# EAGLE schematic atividade-02 (EAGLE 9.6.2)
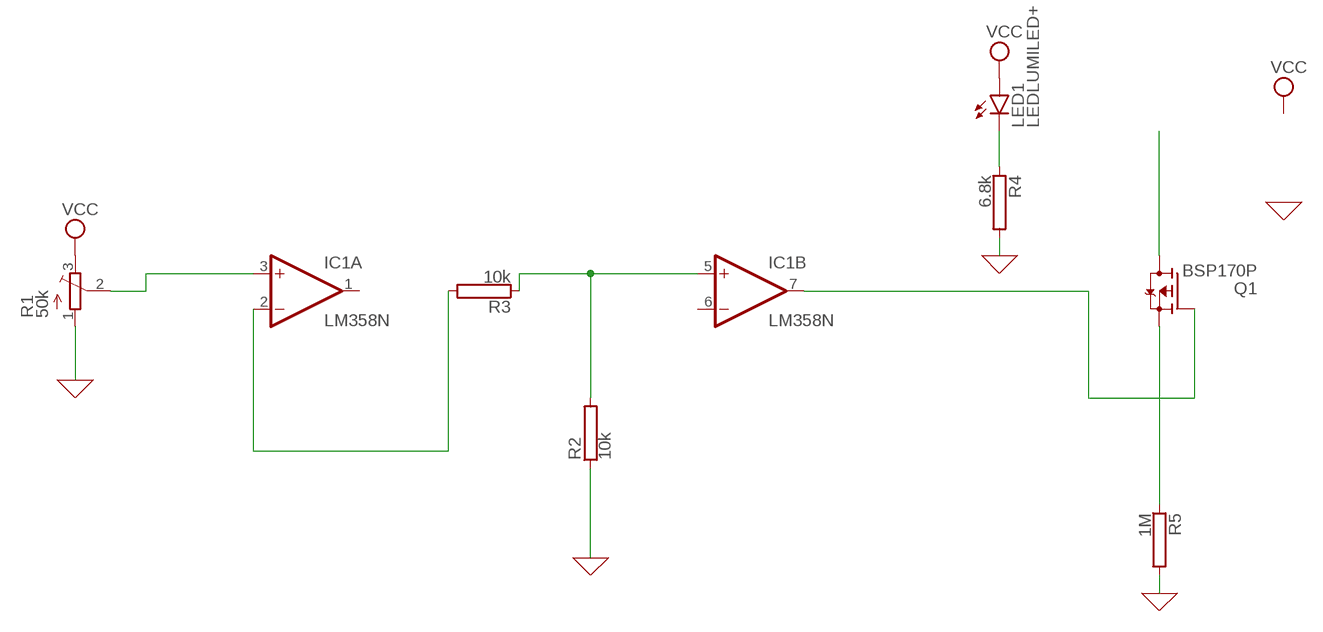
[diagram p0: schematic, sheet 1]

## Parts
IC1  LM358N  [DIL08]
LED1  LEDLUMILED+  [LUMILED+]
Q1  BSP170P  [SOT223]
R1  50k  TRIM_EU-3223G  [3223G]
R2  10k  RAC03  [AC03]
R3  10k  RAC03  [AC03]
R4  6.8k  RAC03  [AC03]
R5  1M  RAC03  [AC03]

## Nets
0: R1.1(A) R2.1 R4.2 R5.2 ; supply symbol labelled GND
N$1: IC1.3(A:+IN) R1.2(S)
N$2: IC1.2(A:-IN) R3.2
N$3: IC1.5(B:+IN) R2.2 R3.1
N$4: IC1.7(B:OUT) Q1.1(G)
N$5: Q1.3(S) R5.1
N$6: Q1.2(D) Q1.4(D)
N$7: LED1.4-(C) R4.1
VCC: LED1.2+(A) R1.3(E)
Unconnected: IC1.1(A:OUT) IC1.6(B:-IN)

## Power pins joined to a net without a drawn wire
V+: IC1.8(P:V+)
V-: IC1.4(P:V-)

## Library data of the parts
IC1 = linear:LM358: OP AMP also LM158; LM258; LM2904 Source: http://cache.national.com/ds/LM/LM158.pdf
LED1 = led-lumiled:LED: LED - LUMILED® LXK2-PW12-R00, LXK2-PW12-S00, LXK2-PW14-U00, LXK2-PW14-V00 LXK2-PM12-R00, LXK2-PM12-S00, LXK2-PM14-U00 LXK2-PE12-Q00, LXK2-PE12-R00, LXK2-PE12-S00, LXK2-PE14-T00, LXK2-PE14-U00 LXK2-PB12-K00, LXK2-PB12-L00, LXK2-PB12-M00, LXK2-PB14-N00, LXK2-PB14-P00, LXK2-PB14-Q00 LXK2-PR12-L00, LXK2-PR12-M00, LXK2-PR14-Q00, LXK2-PR14-R00 LXK2-PD12-Q00, LXK2-PD12-R00, LXK2-PD12-S00 LXK2-PH12-R00, LXK2-PH12-S00 LXK2-PL12-P00, LXK2-PL12-Q00, LXK2-PL12-R00 Source: www.luxeon.com; OC_FARNELL: unknown; OC_NEWARK: unknown
Q1 = transistor-fet:BSP170P: SIPMOS(R) Small-Signal-Transistor P-Channel, Enhancement mode Source: http://www.infineon.com/upload/Document/BSP170P_Rev2.4.pdf
R1 = pot:TRIM_EU-: POTENTIOMETER
R2-R5 = resistor-power:R: Power Resitor; OC_FARNELL: unknown; OC_NEWARK: unknown